# Altium schematic sheet misc.SchDoc: Miscellaneous
size A4; DrawnBy: D.N.Nhuan; Revision: v1.0; SheetNumber: 2; SheetTotal: 2
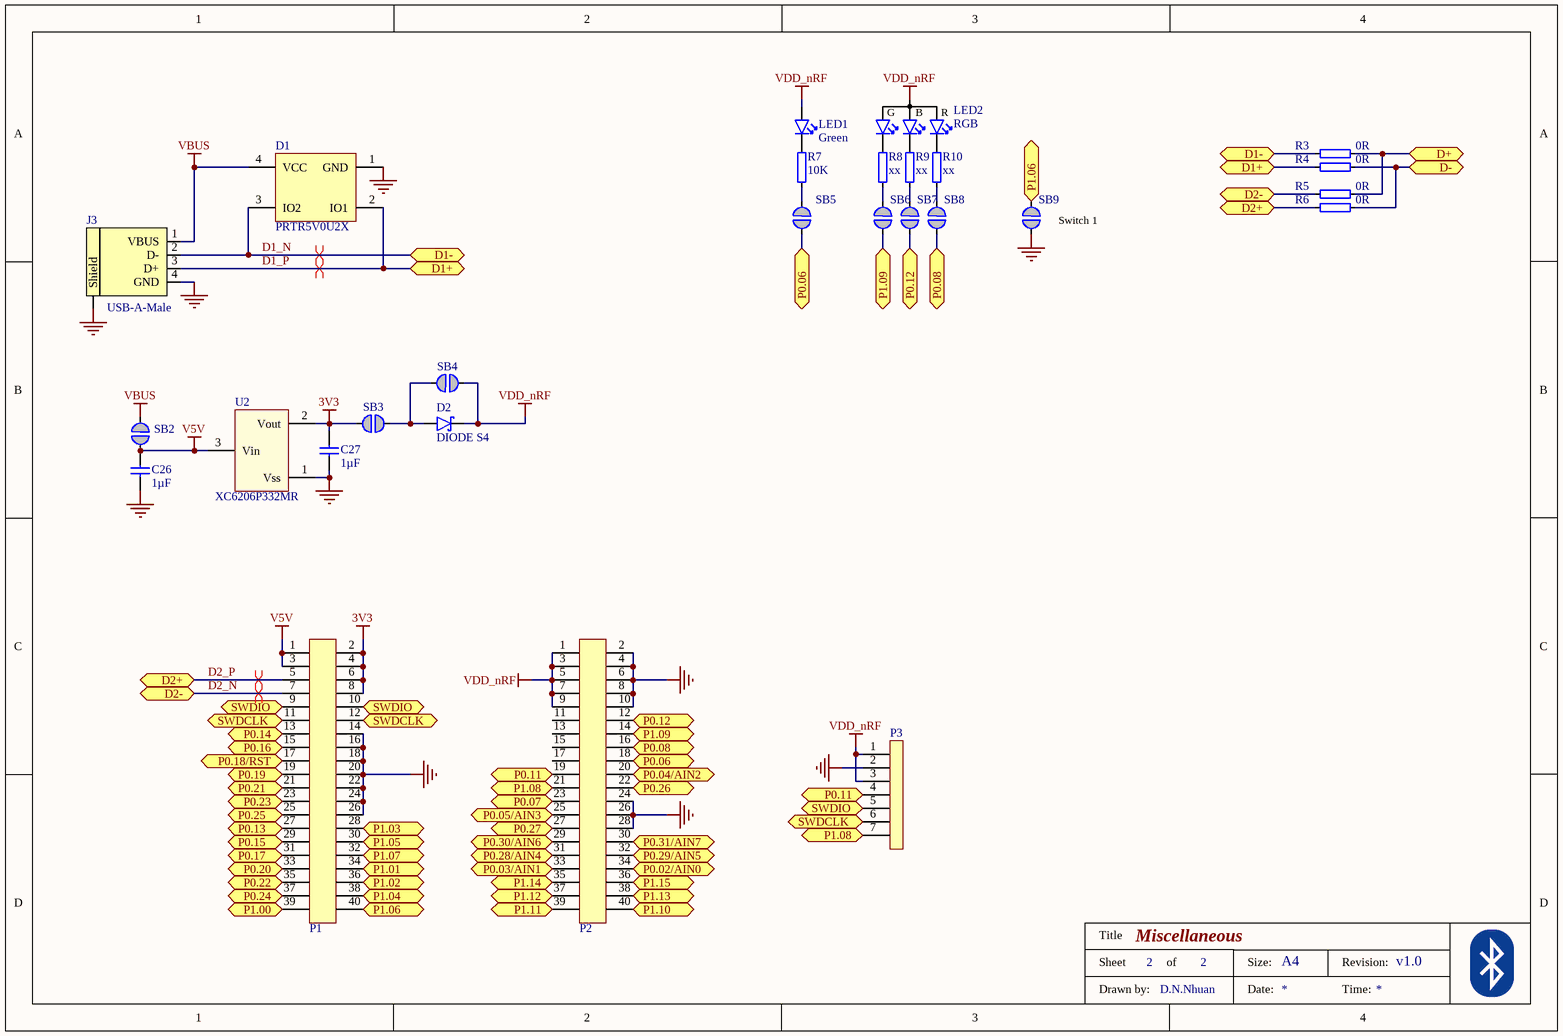
[diagram p0: misc.SchDoc]

## Parts
C26  1µF  [0603_Imperial]
C27  1µF  [0603_Imperial]
D1  PRTR5V0U2X  [SOT190P230X110-4L]
D2  DIODE S4  [SOD-123]
J3  USB-A-Male  [USB-A-DIP]
LED1  Green  [LED_0603]
LED2  RGB  [LED_0603_RGB]
P1  *  [CONN1.27MM2x20_FM_SMD]  (value not drawn)
P2  *  [CONN1.27MM2x20_FM_SMD]  (value not drawn)
P3  7p, 2.54mm  [CONN2.54MM7P]  (value not drawn)
R3  0R  [0402 imperial]
R4  0R  [0402 imperial]
R5  0R  [0402 imperial]
R6  0R  [0402 imperial]
R7  10K  [0402 imperial]
R8  xx  [0402 imperial]
R9  xx  [0402 imperial]
R10  xx  [0402 imperial]
SB2  Solderbridge  [Solderbridge]  (value not drawn)  (no BOM)
SB3  Solderbridge  [Solderbridge]  (value not drawn)  (no BOM)
SB4  Solderbridge  [Solderbridge]  (value not drawn)  (no BOM)
SB5  Solderbridge  [Solderbridge]  (value not drawn)  (no BOM)
SB6  Solderbridge  [Solderbridge]  (value not drawn)  (no BOM)
SB7  Solderbridge  [Solderbridge]  (value not drawn)  (no BOM)
SB8  Solderbridge  [Solderbridge]  (value not drawn)  (no BOM)
SB9  Solderbridge  [Solderbridge]  (value not drawn)  (no BOM)
U2  XC6206P332MR  [SOT-23]

## Ports
D1+, D1-, D2+, D2-, D+, D-, P0.02/AIN0, P0.03/AIN1, P0.04/AIN2, P0.05/AIN3, P0.06, P0.07, P0.08, P0.11, P0.12, P0.13, P0.14, P0.15, P0.16, P0.17, P0.18/RST, P0.19, P0.20, P0.21, P0.22, P0.23, P0.24, P0.25, P0.26, P0.27, P0.28/AIN4, P0.29/AIN5, P0.30/AIN6, P0.31/AIN7, P1.00, P1.01, P1.02, P1.03, P1.04, P1.05, P1.06, P1.07, P1.08, P1.09, P1.10, P1.11, P1.12, P1.13, P1.14, P1.15, SWDCLK, SWDIO

## Nets
3V3: C27.2 P1.2 P1.4 P1.6 P1.8 SB3.2 U2.2(Vout)
GND: C26.1 C27.1 D1.1(GND) J3.4(GND) J3.5(Shield) P1.14 P1.16 P1.18 P1.20 P1.22 P1.24 P1.26 P2.2 P2.4 P2.6 P2.8 P2.10 P2.24 P2.26 P2.28 P3.2 SB9.2 U2.1(Vss)
V5V: C26.2 P1.1 P1.3 SB2.2 U2.3(Vin)
VBUS: D1.4(VCC) J3.1(VBUS) SB2.1
VDD_nRF: D2.1(C) LED1.2(A) LED2.2(A) P2.1 P2.3 P2.5 P2.7 P2.9 P3.1 P3.3 SB4.1
D1_N: D1.3(IO2) J3.2(D-) R3.1 ; port D1-
D1_P: D1.2(IO1) J3.3(D+) R4.1 ; port D1+
D2_N: P1.7 R5.1 ; port D2-
D2_P: P1.5 R6.1 ; port D2+
D+: R3.2 R5.2 ; port D+
D-: R4.2 R6.2 ; port D-
P0.02/AIN0: P2.34 ; port P0.02/AIN0
P0.03/AIN1: P2.33 ; port P0.03/AIN1
P0.04/AIN2: P2.20 ; port P0.04/AIN2
P0.05/AIN3: P2.25 ; port P0.05/AIN3
P0.06: P2.18 SB5.2 ; port P0.06
P0.07: P2.23 ; port P0.07
P0.08: P2.16 SB8.2 ; port P0.08
P0.11: P2.19 P3.4 ; port P0.11
P0.12: P2.12 SB7.2 ; port P0.12
P0.13: P1.27 ; port P0.13
P0.14: P1.13 ; port P0.14
P0.15: P1.29 ; port P0.15
P0.16: P1.15 ; port P0.16
P0.17: P1.31 ; port P0.17
P0.18/RST: P1.17 ; port P0.18/RST
P0.19: P1.19 ; port P0.19
P0.20: P1.33 ; port P0.20
P0.21: P1.21 ; port P0.21
P0.22: P1.35 ; port P0.22
P0.23: P1.23 ; port P0.23
P0.24: P1.37 ; port P0.24
P0.25: P1.25 ; port P0.25
P0.26: P2.22 ; port P0.26
P0.27: P2.27 ; port P0.27
P0.28/AIN4: P2.31 ; port P0.28/AIN4
P0.29/AIN5: P2.32 ; port P0.29/AIN5
P0.30/AIN6: P2.29 ; port P0.30/AIN6
P0.31/AIN7: P2.30 ; port P0.31/AIN7
P1.00: P1.39 ; port P1.00
P1.01: P1.34 ; port P1.01
P1.02: P1.36 ; port P1.02
P1.03: P1.28 ; port P1.03
P1.04: P1.38 ; port P1.04
P1.05: P1.30 ; port P1.05
P1.06: P1.40 SB9.1 ; port P1.06
P1.07: P1.32 ; port P1.07
P1.08: P2.21 P3.7 ; port P1.08
P1.09: P2.14 SB6.2 ; port P1.09
P1.10: P2.40 ; port P1.10
P1.11: P2.39 ; port P1.11
P1.12: P2.37 ; port P1.12
P1.13: P2.38 ; port P1.13
P1.14: P2.35 ; port P1.14
P1.15: P2.36 ; port P1.15
SWDCLK: P1.11 P1.12 P3.6 ; port SWDCLK
SWDIO: P1.9 P1.10 P3.5 ; port SWDIO
NetD2_2: D2.2(A) SB3.1 SB4.2
NetLED1_1: LED1.1(C) R7.2
NetLED2_1: LED2.1(R) R10.2
NetLED2_3: LED2.3(B) R9.2
NetLED2_4: LED2.4(G) R8.2
NetR7_1: R7.1 SB5.1
NetR8_1: R8.1 SB6.1
NetR9_1: R9.1 SB7.1
NetR10_1: R10.1 SB8.1

Not connected (* = marked no-connect by the designer): P2 11 13 15 17

## Layout directives
differential pair: D1_N, D1_P, D2_N, D2_P

## Notes on the sheet
- (near SB9) Switch 1
- Title
- Sheet
- of
- Size:
- A4
- Revision:
- Drawn by:
- Date:
- Time:

## Library data of the parts
C26 C27 = Capacitor: common library; Tolerance: ±5%; Value: 1µF; Link of Supplier: *; Manufacturer: *; Manufacturer Part Number: *; Voltage Rating: *
D1 = PRTR5V0U2X: Ultra low capacitance double rail-to-rail ESD protection diode; Manufacturer: NXP; 2nd source part number: 152-4157; Artikkelnr Noca: 10069015; Artikkelnr Simpro: N.A.; Part Number: PRTR5V0U2X; Manufacturer Part Number: PRTR5V0U2X; Datasheet: http://www.farnell.com/datasheets/109718.pdf; LatestRevisionDate: 2012-06-11; Publisher: Nordic Semiconductor; Published: 2012-06-11; Value: PRTR5V0U2X; Note: *; Supplier: Digi-Key; Supplier part number: 568-4140-1-ND; 2nd source Supplier: Farnell; Footprint Doc: SOT-143B
D2 = Diode Schottky: common library; Value: DIODE S4; Note: *
LED1 = LED: common library; Color: Green; Footprint: 0603
LED2 = LED_RGB: Type: RGB; Supplier: thegioiic
P1 P2 = Header 20x2: Value: *
P3 = Header 7: Value: 7p, 2.54mm
R3-R10 = Resistor: common library; Tolerance: ±5%; Link of Supplier: *; Power Rating: *
  R3-R6: Value: 0R
  R7: Value: 10K
  R8-R10: Value: xx
SB2-SB9 = Solderbridge: Artikkelnr Noca: N.A.; Part Number: Solderbridge; Manufacturer: *; Manufacturer Part Number: *; Datasheet: *; LatestRevisionDate: 2009-12-14; Pin Count: 2; Publisher: Nordic Semiconductor; Published: 2009-12-14; Value: Solderbridge; Note: *; Supplier: *; Supplier part number: *; 2nd source Supplier: *; 2nd source part number: *; Footprint Doc: Solderbridge; Artikkelnr Simpro: N.A.
U2 = XC6206: Low ESR Cap.Compatible Positive Voltage Regulators; Type: XC6206P332MR
J3 = USB-A-Male: Supplier: https://banlinhkien.vn/goods-938-usb-a-duc-smd-usb-a-s01.html; Using reference: https://hshop.vn/products/mach-chuyen-usb-uart-cp2102